# Altium schematic sheet SelfDrivingCar_SCH_Total.SchDoc
size A; DocumentNumber: 1; SheetNumber: 7; SheetTotal: 7
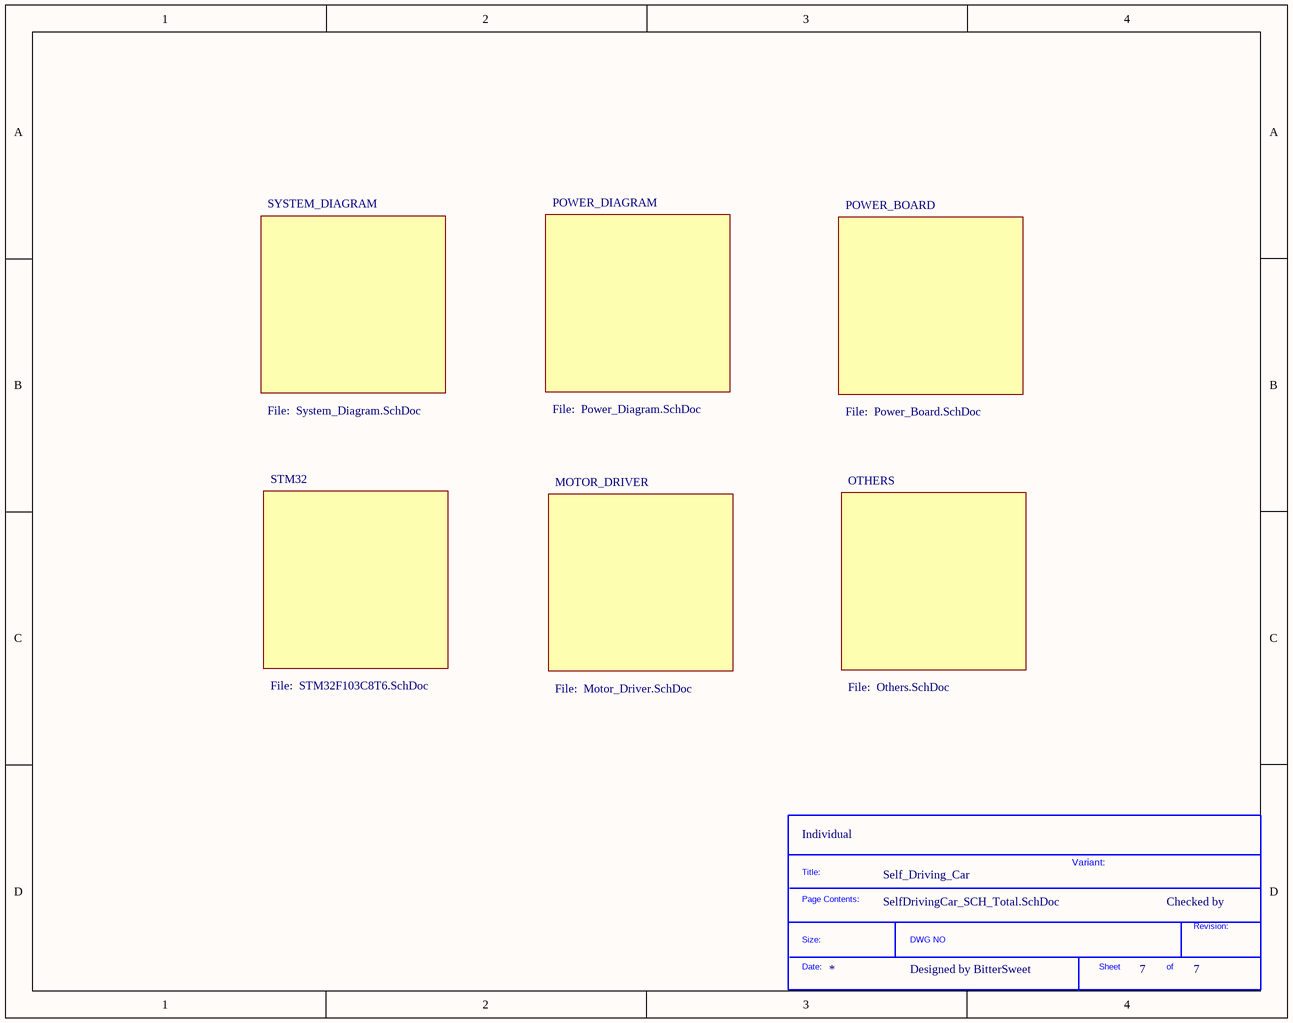
[diagram p0: SelfDrivingCar_SCH_Total.SchDoc]

## Parts
*?  SDTitleBlock  (value not drawn)  (graphical)

## Notes on the sheet
- SYSTEM_DIAGRAM
- POWER_DIAGRAM
- POWER_BOARD
- File:  System_Diagram.SchDoc
- File:  Power_Diagram.SchDoc
- File:  Power_Board.SchDoc
- STM32
- MOTOR_DRIVER
- OTHERS
- File:  STM32F103C8T6.SchDoc
- File:  Motor_Driver.SchDoc
- File:  Others.SchDoc
- (near *?) Individual
- Self_Driving_Car
- Variant:
- Checked by
- Designed by BitterSweet
- (in symbol SDTitleBlock) Title:; Page Contents:; Revision:; Size:; DWG NO; Date:; Sheet; of